# EasyEDA Pro project MAX2831_Standalone.eprj

# Schematic Schematic1
Create Date: 2024-09-24; Page Name: P1; Project Name: MAX2831_Standalone; Schematic Name: Schematic1; Update Date: 2024-09-24; Company: EasyEDA.com; Drawn: EasyEDA; Page Size: A4; Part Number: JLCPCB-002; Reviewed: EasyEDA; Version: V0.1
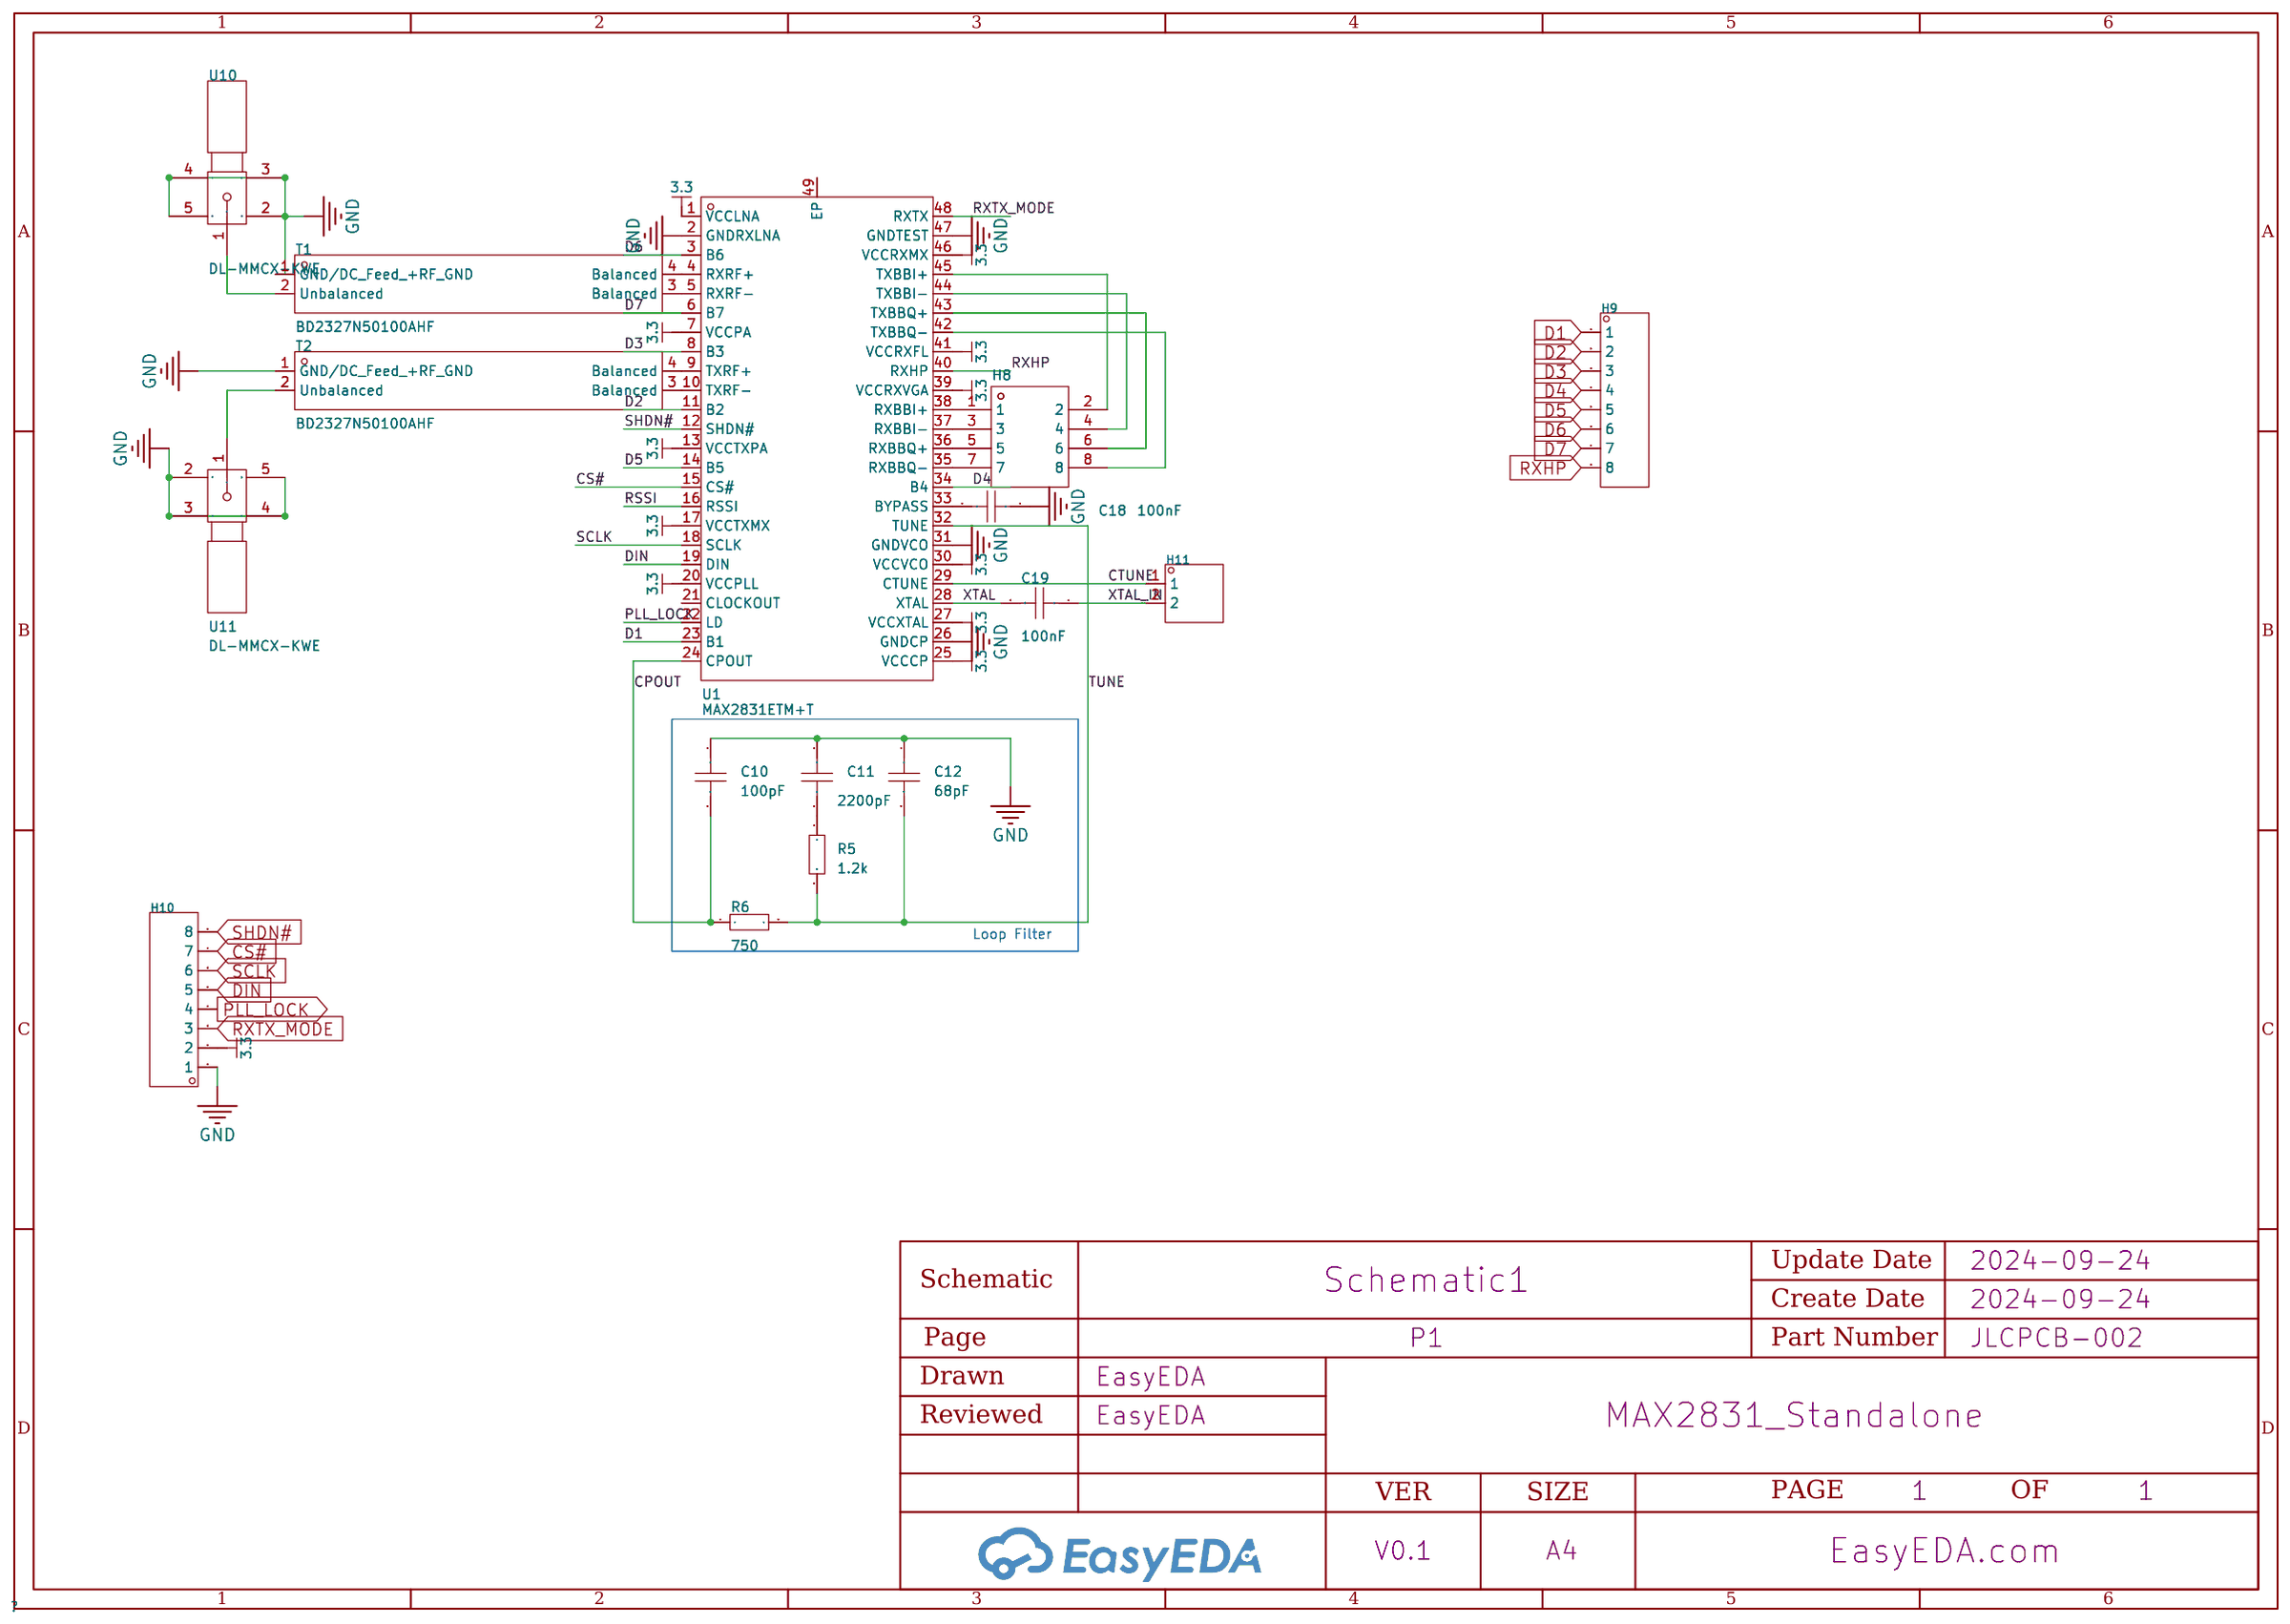
[diagram p0: schematic sheet]

## Parts
C10  100pF  [C0402]
C11  2200pF  [C0402]
C12  68pF  [C0402]
C18  100nF  [C0603]
C19  100nF  [C0603]
H8  -  [HDR-TH_8P-P2.54-V-M-R2-C4-S2.54]
H9  -  [HDR-TH_8P-P2.54-V-M]
H10  -  [HDR-TH_8P-P2.54-V-M]
H11  -  [HDR-TH_2P-P2.54-V-M-1]
R5  1.2k  [R0603]
R6  750  [R0603]
T1  BD2327N50100AHF  [XFMR-SMD_4P-L1.1-W1.1-P0.50-BL]
T2  BD2327N50100AHF  [XFMR-SMD_4P-L1.1-W1.1-P0.50-BL]
U1  MAX2831ETM+T  [TQFN-48_L7.0-W7.0-P0.50-TL-EP5.6]
U10  DL-MMCX-KWE  [MMCX-TH_DL-MMCX-KWE]
U11  DL-MMCX-KWE  [MMCX-TH_DL-MMCX-KWE]

## Library data of the parts
C10-C12 = CAP_0402: Supplier Part: C1525; Supplier Footprint: 0402
C18 C19 = CAP_0603: Supplier Footprint: 0603
H8 = HDR-M_2.54_2x4: Supplier Footprint: Through
H9 H10 = HDR-M_2.54_1x8P: Supplier Footprint: Through
H11 = HDR-M_2.54_1x2P: Supplier Footprint: Through
R5 R6 = Res_0603: Supplier Footprint: 0603
T1 T2 = BD2327N50100AHF: Frequency Range:2.3GHz~2.7GHz Frequency Range:2.3GHz~2.7GHz Impedance Ratio-Unbalanced/Balanced:50Ω:100Ω Insertion Loss (Max):0.6dB Phase Balance:7° Return Loss (Min):-17dB; Supplier Part: C502744; Manufacturer: Anaren(安伦); Supplier Footprint: 0404; JLCPCB Part Class: Extended Part; Datasheet: https://atta.szlcsc.com/upload/public/pdf/source/20200325/C502744_600AEA0B929E69ACF1DE72B8D5B44231.pdf; Supplier: LCSC; Frequency Range: 2.3GHz~2.7GHz; Impedance Ratio-Unbalanced/Balanced: 50Ω:100Ω; Insertion Loss (Max): 0.6dB; Phase Balance: 7°; Return Loss (Min): -17dB
U1 = MAX2831ETM+T: Frequency Range:2.4GHz Frequency Range:2.4GHz Interface:SPI Operating Voltage:2.7V~3.6V Operating Voltage:2.7V~3.6V Applications:WiFi Output Power:21dBm Data Rate:54Mbps Current Of Transmitting:82mA Sensitivity:-76dBm Receive Current:62mA Operating Temper; Supplier Part: C2152047; Manufacturer: ADI(亚德诺)/MAXIM(美信); Supplier Footprint: TQFN-48-EP(7x7); JLCPCB Part Class: Extended Part; Datasheet: https://atta.szlcsc.com/upload/public/pdf/source/20210601/D5E13A4F591163B65DE03F91E5182685.pdf; Supplier: LCSC; Frequency Range: 2.4GHz; Interface: SPI; Operating Voltage: 2.7V~3.6V; Applications: WiFi; Output Power: 21dBm; Data Rate: 54Mbps; Current Of Transmitting: 82mA; Sensitivity: -76dBm; Receive Current: 62mA; Operating Temperature: -40℃~+85℃
U10 U11 = DL-MMCX-KWE: LCSC Part Name: MMCX弯头座子 内孔; Supplier Part: C5180385; Manufacturer: DEALON(德艺隆); Supplier Footprint: 插件; JLCPCB Part Class: Extended Part; Datasheet: https://atta.szlcsc.com/upload/public/pdf/source/20221009/4485301091695522217BB293DC16212E.pdf; Supplier: LCSC

## Nets
GND: C10.1 C11.1 C12.1 C18.1 H10.1 T1.1(GND/DC Feed +RF GND) T2.1(GND/DC Feed +RF GND) U1.2(GNDRXLNA) U1.26(GNDCP) U1.31(GNDVCO) U1.47(GNDTEST) U10.2 U10.3 U10.4 U10.5 U11.2 U11.3 U11.4 U11.5
3.3: H10.2 U1.1(VCCLNA) U1.7(VCCPA) U1.13(VCCTXPA) U1.17(VCCTXMX) U1.20(VCCPLL) U1.25(VCCCP) U1.27(VCCXTAL) U1.30(VCCVCO) U1.39(VCCRXVGA) U1.41(VCCRXFL) U1.46(VCCRXMX)
CPOUT: C10.2 R6.1 U1.24(CPOUT)
CS#: H10.7 U1.15(CS#)
CTUNE: H11.1 U1.29(CTUNE)
D1: H9.1 U1.23(B1)
D2: H9.2 U1.11(B2)
D3: H9.3 U1.8(B3)
D4: H9.4 U1.34(B4)
D5: H9.5 U1.14(B5)
D6: H9.6 U1.3(B6)
D7: H9.7 U1.6(B7)
DIN: H10.5 U1.19(DIN)
PLL_LOCK: H10.4 U1.22(LD)
RSSI: U1.16(RSSI)
RXHP: H9.8 U1.40(RXHP)
RXTX_MODE: H10.3 U1.48(RXTX)
SCLK: H10.6 U1.18(SCLK)
SHDN#: H10.8 U1.12(SHDN#)
TUNE: C12.2 R5.2 R6.2 U1.32(TUNE)
XTAL: C19.2 U1.28(XTAL)
XTAL_IN: C19.1 H11.2
$1N1573: C11.2 R5.1
$1N2083: C18.2 U1.33(BYPASS)
$1N2220: T1.4(Balanced) U1.4(RXRF+)
$1N2222: T1.3(Balanced) U1.5(RXRF-)
$1N2224: T2.4(Balanced) U1.9(TXRF+)
$1N2226: T2.3(Balanced) U1.10(TXRF-)
$1N4327: H8.2 U1.45(TXBBI+)
$1N4335: H8.4 U1.44(TXBBI-)
$1N4341: H8.6 U1.43(TXBBQ+)
$1N4346: H8.8 U1.42(TXBBQ-)
$1N4508: T2.2(Unbalanced) U11.1
$1N4512: T1.2(Unbalanced) U10.1
$1N5251: H8.1 U1.38(RXBBI+)
$1N5253: H8.3 U1.37(RXBBI-)
$1N5255: H8.5 U1.36(RXBBQ+)
$1N5257: H8.7 U1.35(RXBBQ-)

Not connected (* = marked no-connect by the designer): U1 21(CLOCKOUT) 49(EP)

## Notes on the sheet
- Loop Filter

# Schematic Schematic2
Create Date: 2024-09-25; Page Name: P1; Project Name: MAX2831_Standalone; Schematic Name: Schematic2; Update Date: 2024-09-25; Company: EasyEDA.com; Drawn: EasyEDA; Page Size: A4; Part Number: JLCPCB-002; Reviewed: EasyEDA; Version: V0.1
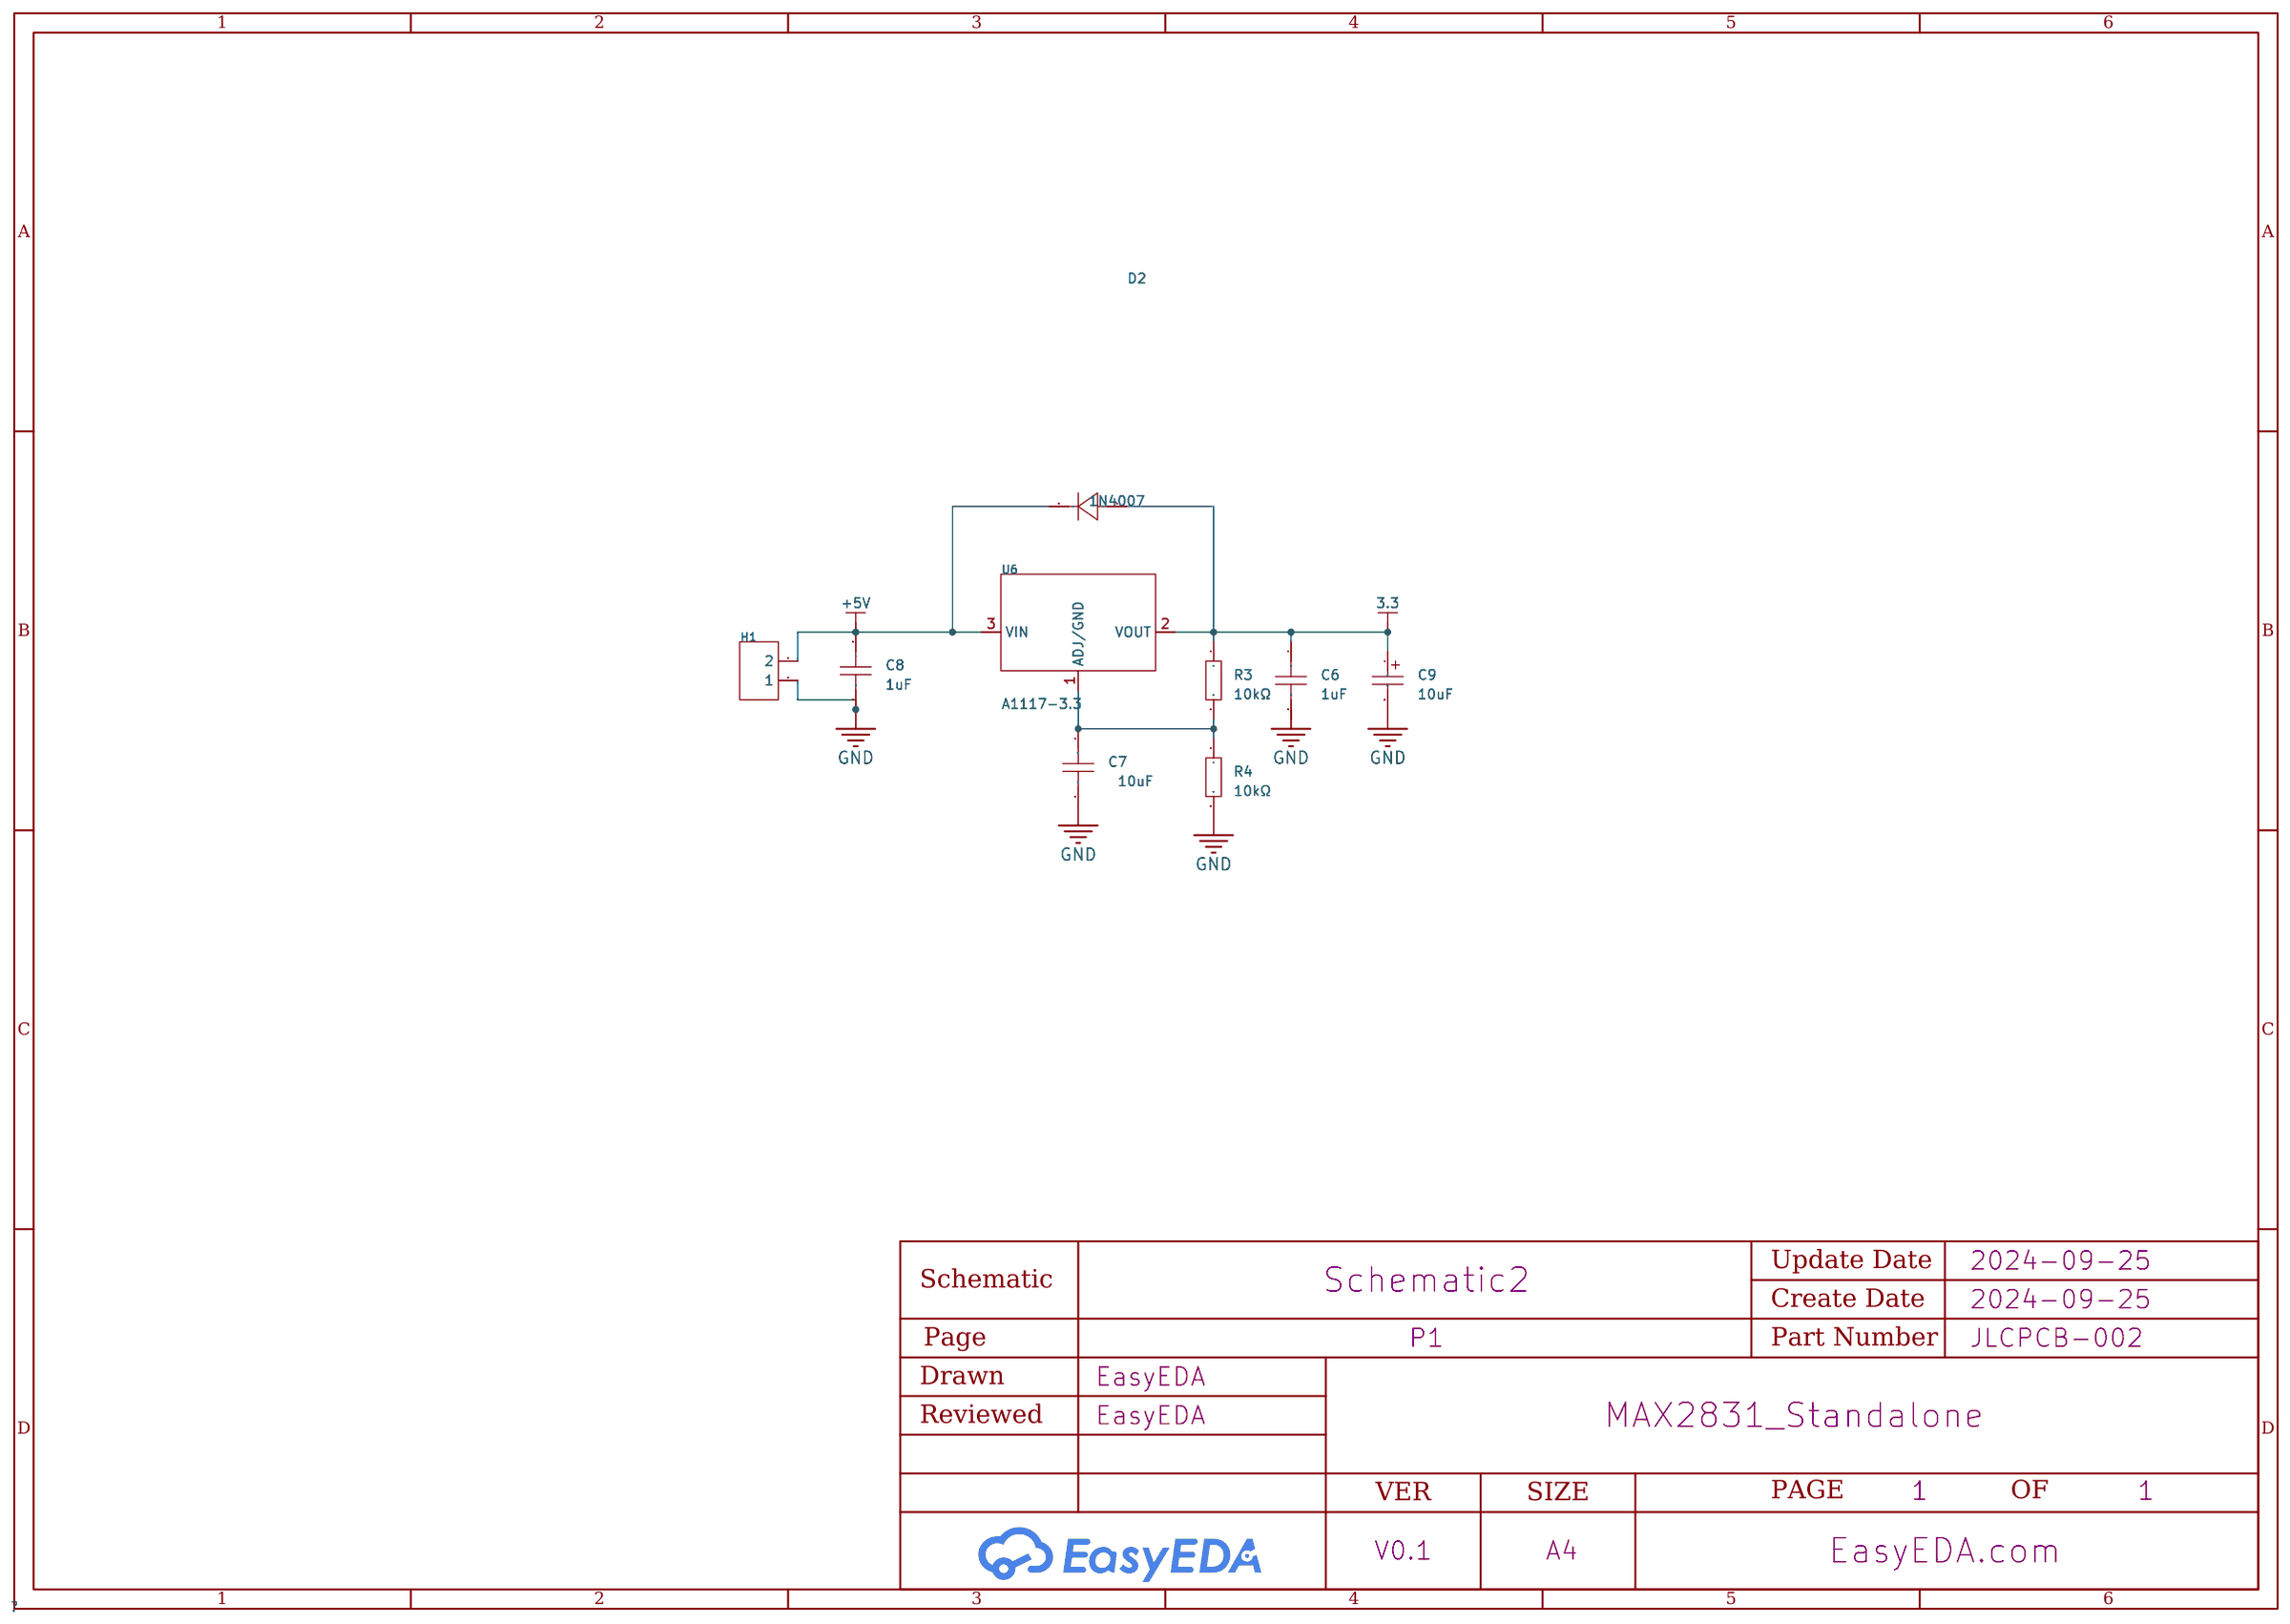
[diagram p1: schematic sheet]

## Parts
C6  1uF  [C0603]
C7  10uF  [C0603]
C8  1uF  [C0603]
C9  10uF  [CAP-SMD_BD3.0-L3.3-W3.3-RD]
D2  1N4007  [SMAF_L3.5-W2.6-LS4.7-RD]
H1  -  [HDR-TH_2P-P2.54-V-F]
R3  10kΩ  [RES-TH_BD3.3-L9.0-P13.00-D0.6]
R4  10kΩ  [RES-TH_BD3.3-L9.0-P13.00-D0.6]
U6  A1117-3.3  [SOT-223-3_L6.5-W3.4-P2.30-LS7.0-BR-1]

## Library data of the parts
C6-C8 = CAP_0603: Supplier Footprint: 0603
C9 = C_Ele_SMD_3x5.4mm: Supplier Footprint: SMD,3x5.4mm
D2 = 1N4007_C2909975: Diode Configuration:Independent Type Forward Voltage (Vf@If):1.1V@1A Reverse Voltage (Vr): Rectified Current: Reverse Leakage Current:5uA@1kV; LCSC Part Name: 电压:1kV 电流:1A; Supplier Part: C2909975; Manufacturer: YONGYUTAI(永裕泰); Supplier Footprint: SMAF; JLCPCB Part Class: Extended Part; Datasheet: https://atta.szlcsc.com/upload/public/pdf/source/20211027/84ABD1D59134F7D0F7A37088EC700D05.pdf; Supplier: LCSC; Diode Configuration: Independent Type; Forward Voltage (Vf@If): 1.1V@1A; Reverse Leakage Current: 5uA@1kV
H1 = HDR-F_2.54_1x2P: Supplier Footprint: Through
R3 R4 = Res_AXIAL-1/2W: Supplier Footprint: Through
U6 = A1117-3.3: MAX Output Current:1A Feature:Overcurrent Protection；过热保护; LCSC Part Name: AMS1117-3.3; Supplier Part: C7432020; Manufacturer: IDCHIP(英锐芯); Supplier Footprint: SOT-223; JLCPCB Part Class: Extended Part; Datasheet: https://atta.szlcsc.com/upload/public/pdf/source/20230625/435FEEFA02C0FE449E7397A11F8448E0.pdf; Supplier: LCSC; MAX Output Current: 1A; Feature: Overcurrent Protection；过热保护

## Nets
+5V: C8.1 D2.1(K) H1.2 U6.3(VIN)
GND: C6.2 C7.2 C8.2 C9.2 H1.1 R4.2
3.3: C6.1 C9.1 D2.2(A) R3.1 U6.2(VOUT)
Net-(C7-1): C7.1 R3.2 R4.1 U6.1(ADJ/GND)

# Board PCB1
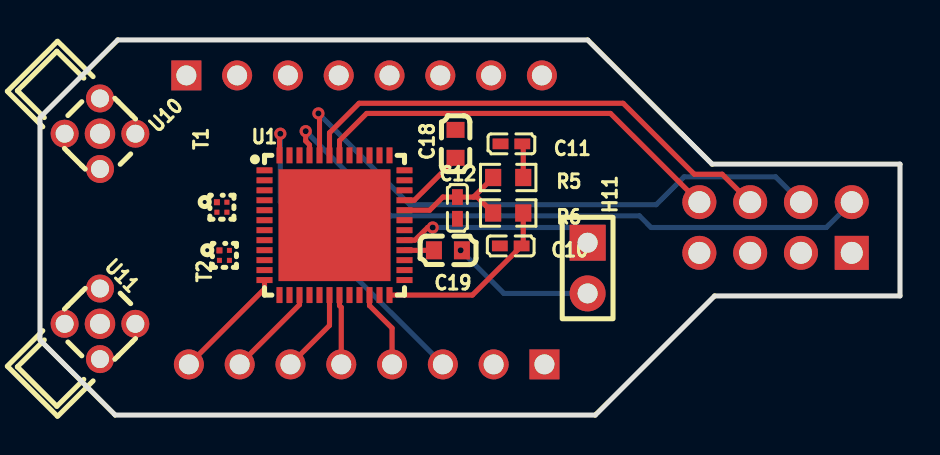
[diagram p2: board, top side]
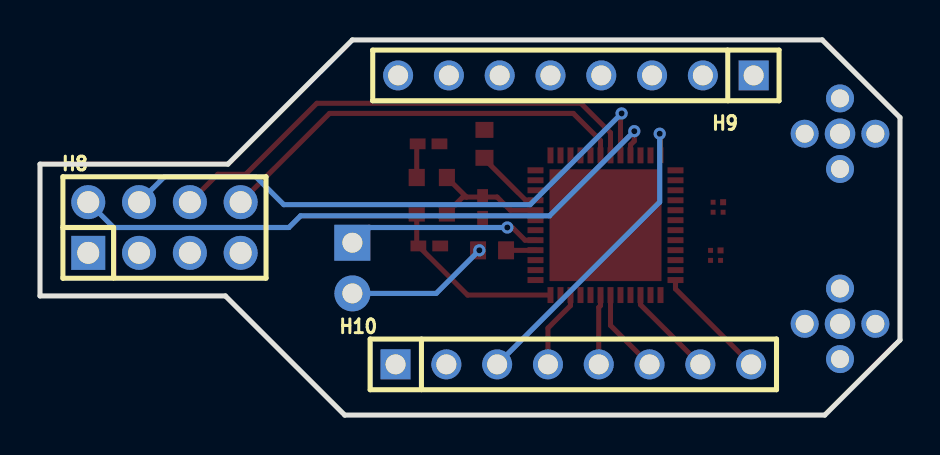
[diagram p3: board, bottom side, seen from below]

Outline 43.01 x 18.8 mm; copper layers: Top Layer, GND, Inner2, Inner3, 3.3, Bottom Layer. Coordinates in mm from the lower left corner of the outline.
Outline path: 0,14.91 0,3.76 3.76,0 27.77,0 33.73,5.97 43.01,5.97 43.01,12.57 33.61,12.57 27.38,18.8 3.89,18.8 0,14.91
Stack: Top Layer 0.035mm 外层铜厚1oz / Dielectric1 0.0994mm 3313 RC57% 4.2mil / GND 0.0152mm 内层铜厚 / Dielectric2 0.55mm 0.55mm H/H不含铜 / Inner2 0.0152mm 内层铜厚 / Dielectric3 0.1088mm 2116 RC54% 4.9mil / Inner3 0.0152mm 内层铜厚 / Dielectric4 0.55mm 0.55mm H/H不含铜 / 3.3 0.0152mm 内层铜厚 / Dielectric5 0.0994mm 3313 RC57% 4.2mil / Bottom Layer 0.035mm 外层铜厚1oz

## Design rules (mm)
template: JLCPCB Capability(Two Layers Board)
spacing copperThickness1oz (default): track to track 0.102, other pairs 0.152 to 0.3
spacing copperThickness2oz: track to track 0.203, other pairs 0.152 to 0.3
track width copperThickness1oz (default): min 0.127, default 0.254, max 2.54
track width copperThickness2oz: min 0.203, default 0.254, max 2.54
differential pair differentialPair (default): width min 0.127, default 0.254, max 2.54; gap min 0.152, default 0.152
via viaSize (default): diameter min 0.5, default 0.61, max 10; hole min 0.3, default 0.305, max 6.3

## Placement (name value [footprint] x y rotation side)
C10  100pF  [C0402]  23.54 8.47 0 top
C11  2200pF  [C0402]  23.57 13.59 0 top
C12  68pF  [C0402]  20.87 10.38 90 top
C18  100nF  [C0603]  20.78 13.59 270 top
C19  100nF  [C0603]  20.4 8.25 180 top
H8  -  [HDR-TH_8P-P2.54-V-M-R2-C4-S2.54]  36.78 9.4 180 bottom
H9  -  [HDR-TH_8P-P2.54-V-M]  16.21 17.02 0 bottom
H10  -  [HDR-TH_8P-P2.54-V-M]  16.34 2.54 180 bottom
H11  -  [HDR-TH_2P-P2.54-V-M-1]  27.38 7.37 270 top
R5  1.2k  [R0603]  23.41 11.9 180 top
R6  750  [R0603]  23.41 10.12 180 top
T1  BD2327N50100AHF  [XFMR-SMD_4P-L1.1-W1.1-P0.50-BL]  9.1 10.41 270 top
T2  BD2327N50100AHF  [XFMR-SMD_4P-L1.1-W1.1-P0.50-BL]  9.22 8 270 top
U1  MAX2831ETM+T  [TQFN-48_L7.0-W7.0-P0.50-TL-EP5.6]  14.73 9.51 0 top
U10  DL-MMCX-KWE  [MMCX-TH_DL-MMCX-KWE]  3 14.1 225 top
U11  DL-MMCX-KWE  [MMCX-TH_DL-MMCX-KWE]  3 4.57 315 top

## Footprints (pads in the part's own frame, mm; a bottom-side part is the same pattern mirrored in y, then rotated)
C0402
  rect 0.79x0.54 smd: 1(-0.545,0) 2(0.545,0)
C0603
  rect 0.8x0.9 smd: 1(-0.7,0) 2(0.7,0)
HDR-TH_2P-P2.54-V-M-1
  rect 1.8x1.8 hole 1: 1(-1.27,0)
  round 1.8 hole 1: 2(1.27,0)
HDR-TH_8P-P2.54-V-M
  rect 1.5x1.5 hole 1: 1(-8.89,0)
  round 1.5 hole 1: 2(-6.35,0) 3(-3.81,0) 4(-1.27,0) 5(1.27,0) 6(3.81,0) 7(6.35,0) 8(8.89,0)
HDR-TH_8P-P2.54-V-M-R2-C4-S2.54
  rect 1.7x1.7 hole 1.1: 1(-3.81,-1.27)
  round 1.7 hole 1.1: 2(-3.81,1.27) 3(-1.27,-1.27) 4(-1.27,1.27) 5(1.27,-1.27) 6(1.27,1.27) 7(3.81,-1.27) 8(3.81,1.27)
MMCX-TH_DL-MMCX-KWE
  round 1.524 hole 1: 1(0,0)
  round 1.4 hole 0.9: 2(-1.25,1.25) 3(-1.25,-1.25) 4(1.25,-1.25) 5(1.25,1.25)
R0603
  rect 0.806x0.864 smd: 1(-0.753,0) 2(0.753,0)
TQFN-48_L7.0-W7.0-P0.50-TL-EP5.6
  rect 0.8x0.3 smd: 1(-3.5,2.751) 2(-3.5,2.251) 3(-3.5,1.75) 4(-3.5,1.251) 5(-3.5,0.75) 6(-3.5,0.252) 7(-3.5,-0.249) 8(-3.5,-0.75) 9(-3.5,-1.25) 10(-3.5,-1.75) 11(-3.5,-2.249) 12(-3.5,-2.748) 25(3.5,-2.748) 26(3.5,-2.249) 27(3.5,-1.75) 28(3.5,-1.25) 29(3.5,-0.75) 30(3.5,-0.249) 31(3.5,0.252) 32(3.5,0.75) 33(3.5,1.251) 34(3.5,1.75) 35(3.5,2.251) 36(3.5,2.751)
  rect 0.3x0.8 smd: 13(-2.751,-3.5) 14(-2.251,-3.5) 15(-1.75,-3.5) 16(-1.25,-3.5) 17(-0.75,-3.5) 18(-0.251,-3.5) 19(0.249,-3.5) 20(0.75,-3.5) 21(1.25,-3.5) 22(1.75,-3.5) 23(2.251,-3.5) 24(2.751,-3.5) 37(2.751,3.5) 38(2.251,3.5) 39(1.75,3.5) 40(1.25,3.5) 41(0.75,3.5) 42(0.251,3.5) 43(-0.251,3.5) 44(-0.75,3.5) 45(-1.25,3.5) 46(-1.75,3.5) 47(-2.251,3.5) 48(-2.751,3.5)
  rect 5.6x5.6 smd: 49(0,0.001)
XFMR-SMD_4P-L1.1-W1.1-P0.50-BL
  rect 0.3x0.3 smd: 1(-0.25,-0.25)
  rect 0.25x0.25 smd: 2(0.25,-0.25) 3(0.25,0.25) 4(-0.25,0.25)

## Nets
As in the schematic.

Pads without a net: U1 21 49

## Via types
v1: diameter 0.61, hole 0.305, Top Layer to Bottom Layer, 5 vias

## Routing (per net, layer and track width the routed paths; a pad name or vN(x,y) marks a point on that pad's centre or on a via; arc(x,y) is an arc through that point)
CPOUT: length 9.3
  Top Layer w0.254: R6.1 24.17,8.56 C10.2 21.62,6.01 U1.24
CS#: length 4.7
  Top Layer w0.254: H10.7 12.98,5.53 U1.15
CTUNE: length 9.7
  Top Layer w0.254: v1(19.64,9.4) 19.38,9.4 18.75,8.76 U1.29
  Bottom Layer w0.254: H11.1 26.62,9.4 v1(19.64,9.4)
DIN: length 3.5
  Top Layer w0.254: 15.07,2.54 15.07,5.4 14.98,5.49 U1.19
PLL_LOCK: length 3.9
  Top Layer w0.254: H10.4 17.61,4.36 16.48,5.49 U1.22
RXTX_MODE: length 16
  Top Layer w0.254: v1(12.02,14.1) 11.98,14.06 U1.48
  Bottom Layer w0.254: v1(12.02,14.1) 12.02,10.67 H10.3
SCLK: length 4.3
  Top Layer w0.254: U1.18 14.48,4.49 H10.6
SHDN#: length 5.8
  Top Layer w0.254: U1.12 11.23,6.32 H10.8
TUNE: length 6.4
  Top Layer w0.254: R5.2 21.68,10.92 ; 21.68,10.92 C12.2 20.15,10.92 19.49,10.26 U1.32 ; 21.68,10.92 21.86,10.92 R6.2
XTAL: length 1.5
  Top Layer w0.254: U1.28 18.23,8.25 C19.2
XTAL_IN: length 7.3
  Top Layer w0.254: v1(21.03,8.25) C19.1
  Bottom Layer w0.254: H11.2 23.19,6.1 v1(21.03,8.25)
$1N1573: length 1.7
  Top Layer w0.254: C11.2 24.17,13.54 R5.1
$1N2083: length 3.5
  Top Layer w0.254: C18.2 20.78,12.83 18.72,10.76 U1.33
$1N4327: length 31.1
  Top Layer w0.254: v1(13.29,14.22) 13.29,13.73 13.48,13.54 U1.45
  Bottom Layer w0.254: v1(13.29,14.22) 17.53,9.98 29.97,9.98 30.56,9.4 39.32,9.4 H8.2
$1N4335: length 29.3
  Top Layer w0.254: v1(13.92,15.11) 13.98,15.06 U1.44
  Bottom Layer w0.254: H8.4 36.78,11.94 32.21,11.94 30.81,10.54 18.49,10.54 v1(13.92,15.11)
$1N4341: length 24.8
  Top Layer w0.254: U1.43 14.48,14.14 15.95,15.62 29.16,15.62 32.72,12.06 34.12,12.06 H8.6
$1N4346: length 21.1
  Top Layer w0.254: U1.42 14.98,13.76 16.34,15.11 28.53,15.11 H8.8

## Copper pours and planes (outline as drawn; the poured copper is in the pictures)
GND on GND: 0.26,18.54 42.75,18.54 42.75,0.26 0.26,0.26
GND on 3.3: 0.26,18.54 42.75,18.54 42.75,0.26 0.26,0.26

Small or netless copper shapes (teardrops, artwork), in the pictures only: 36 on GND, 36 on 3.3
